# EAGLE design plugin-sensor (EAGLE 9.6.2)
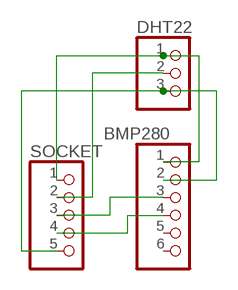
[diagram p0: schematic, sheet 1]

## Parts
BMP280  PINHD-1X6/90  [1X06/90]
DHT22  PINHD-1X3  [1X03]
SOCKET  PINHD-1X5/90  [1X05/90]

## Nets
N$1: BMP280.1 DHT22.1 SOCKET.1
N$2: BMP280.2 DHT22.3 SOCKET.5
N$3: DHT22.2 SOCKET.2
N$5: BMP280.3 SOCKET.3
N$6: BMP280.4 SOCKET.4
Unconnected: BMP280.5 BMP280.6

## Library data of the parts
BMP280 = pinhead:PINHD-1X6: PIN HEADER
DHT22 = pinhead:PINHD-1X3: PIN HEADER
SOCKET = pinhead:PINHD-1X5: PIN HEADER

## Board
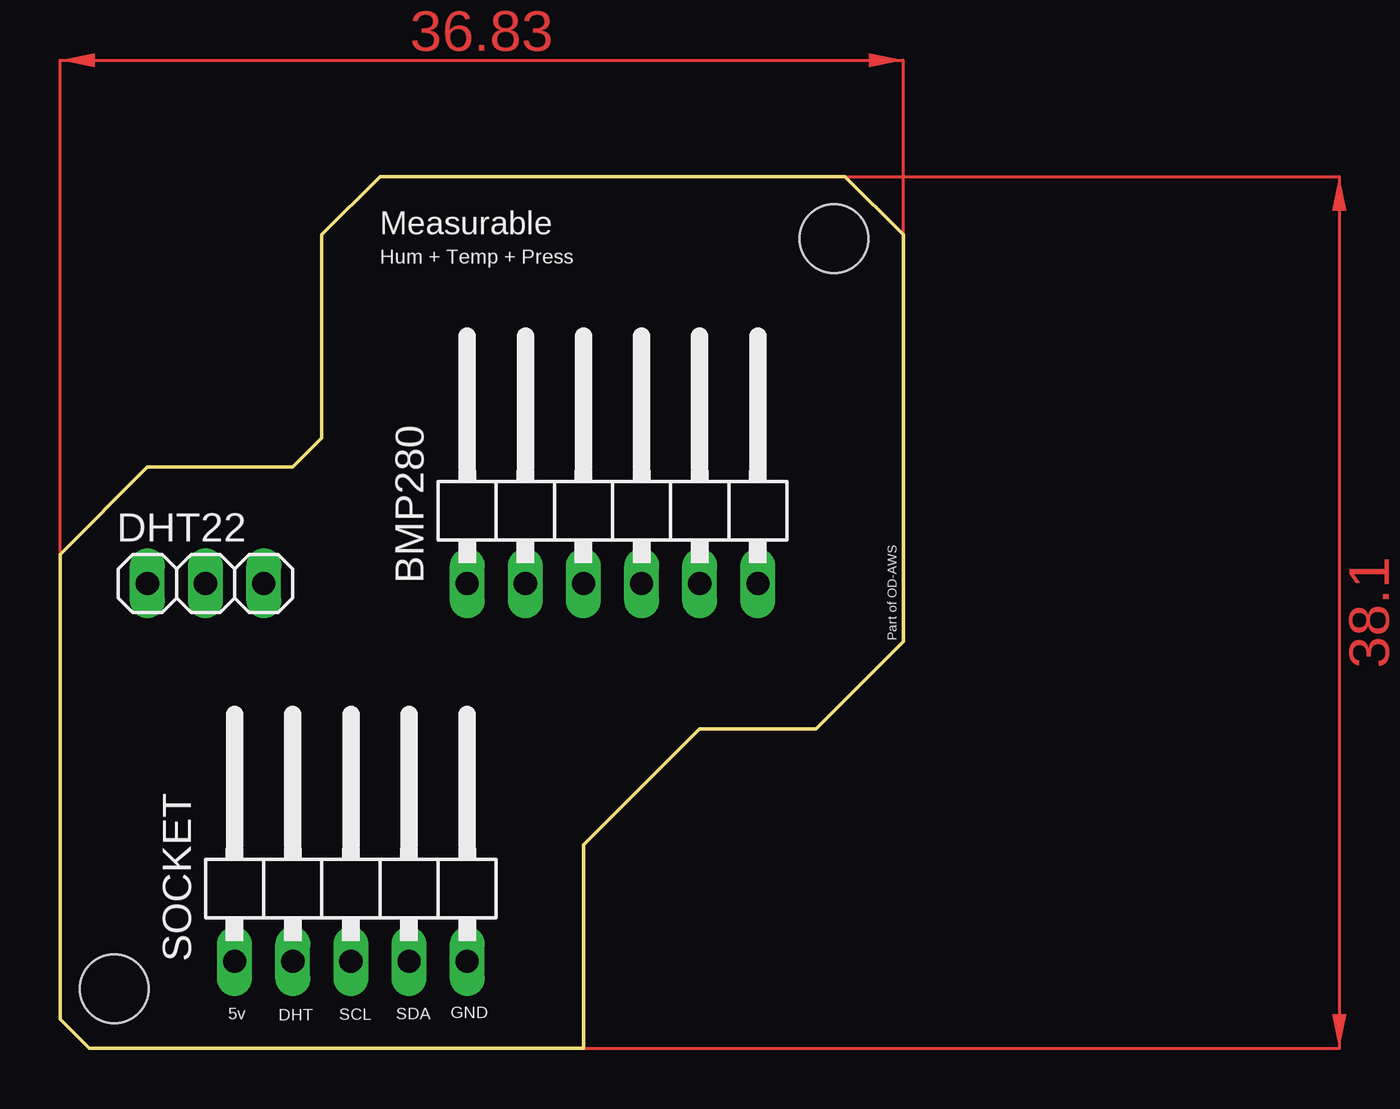
[diagram p1: board, top side]
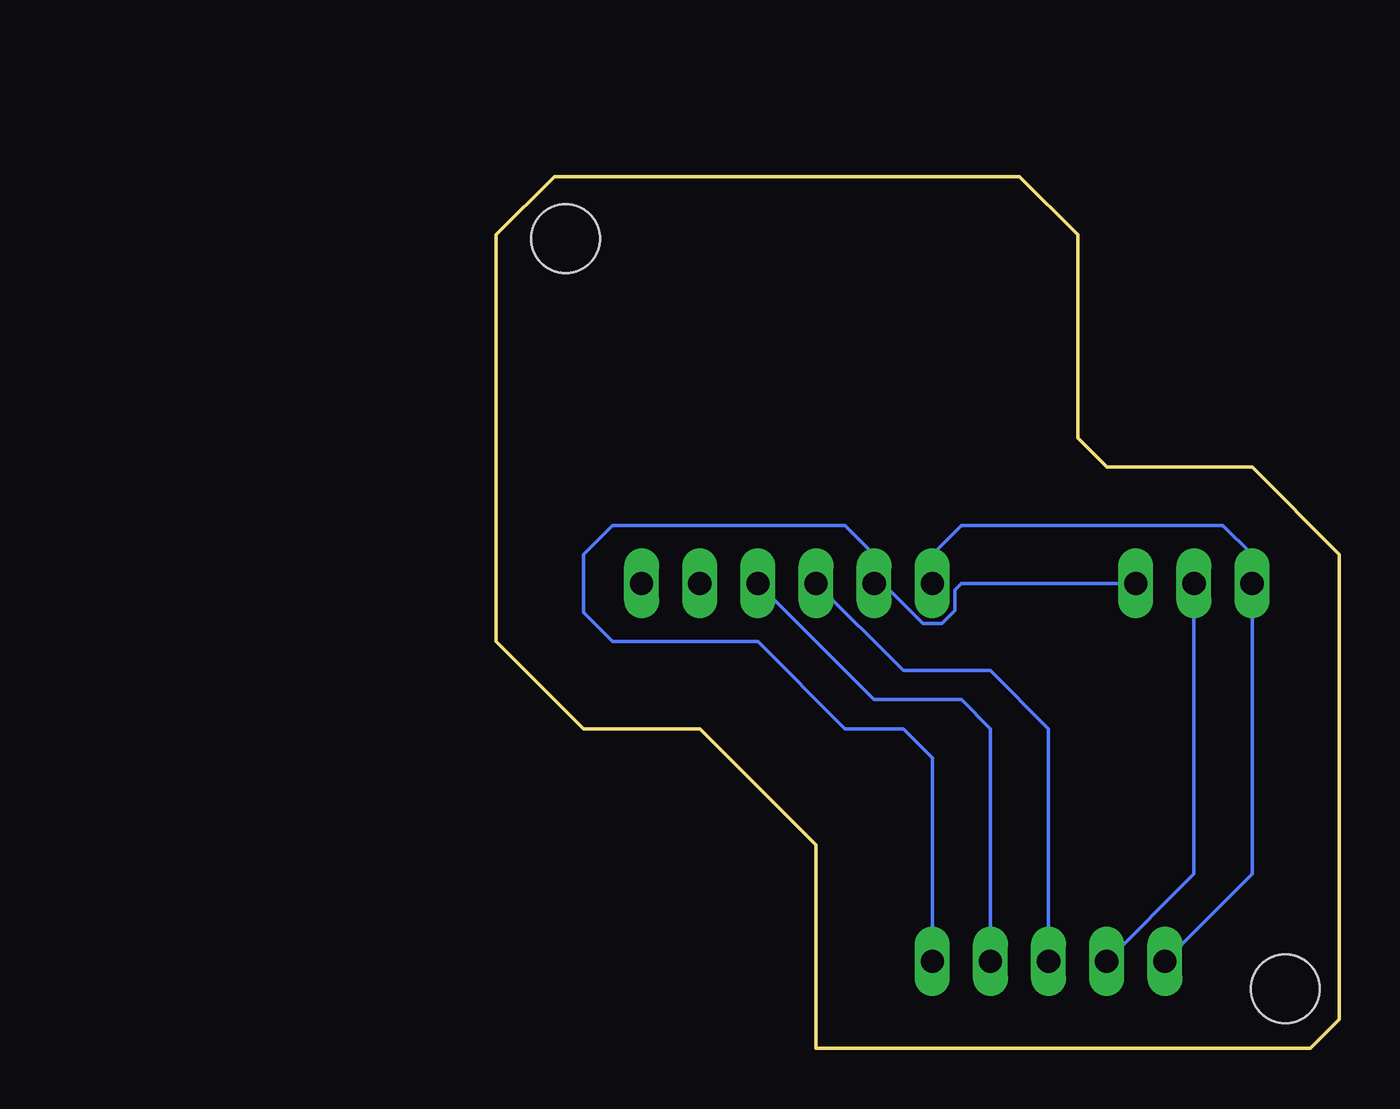
[diagram p2: board, bottom side, seen from below]

Size 36.83 x 38.1 mm. Coordinates in mm from the lower left corner, seen from the top.
Outline: 1.27,0 22.86,0 22.86,8.89 27.94,13.97 33.02,13.97 36.83,17.78 36.83,35.56 34.29,38.1 13.97,38.1 11.43,35.56 11.43,26.67 10.16,25.4 3.81,25.4 0,21.59 0,1.27 1.27,0
Copper layers (1*16): Top 0.035mm / dielectric 1.5mm / Bottom 0.035mm
Design rules "default": minimum track width 6mil, minimum drill 0.35mm, track to track 6mil, track to pad 6mil, pad to pad 6mil, via to via 6mil, smd to smd 6mil, copper to edge 40mil, drill to drill 6mil, minimum pad ring 10mil, minimum via ring 8mil, stop-mask expansion 4mil, vias tented up to drill 0mil, thermal gap 10mil
Holes 3 mm at 33.81,35.38 2.36,2.62

### Footprints (pad centres in the part's own frame; a part is rotated, then mirrored left to right if it is on the bottom)
1X06/90 = drill 1.016 long: 1 -6.35,-3.81; 2 -3.81,-3.81; 3 -1.27,-3.81; 4 1.27,-3.81; 5 3.81,-3.81; 6 6.35,-3.81
1X03 = drill 1.016 long: 1 -2.54,0; 2 0,0; 3 2.54,0
1X05/90 = drill 1.016 long: 1 -5.08,-3.81; 2 -2.54,-3.81; 3 0,-3.81; 4 2.54,-3.81; 5 5.08,-3.81

### Placement (x,y rotation side)
BMP280  24.13,24.13 0 top
DHT22  6.35,20.32 0 top
SOCKET  12.7,7.62 0 top

### Tracks (layer width: path | path; a pad name or v marks a point on that pad's centre or on a via)
N$1
  Bottom 0.152: SOCKET.1 3.81,7.62 DHT22.1 3.81,21.59 5.08,22.86 16.51,22.86 17.78,21.59 BMP280.1
N$2
  Bottom 0.152: DHT22.3 16.51,20.32 16.79,20.04 16.79,19.15 17.37,18.57 18.19,18.57 19.94,20.32 BMP280.2 20.32,21.59 21.59,22.86 31.75,22.86 33.02,21.59 33.02,19.05 31.75,17.78 25.4,17.78 21.59,13.97 19.05,13.97 17.78,12.7 SOCKET.5
N$3
  Bottom 0.152: DHT22.2 6.35,7.62 SOCKET.2
N$5
  Bottom 0.152: BMP280.3 19.05,16.51 15.24,16.51 12.7,13.97 SOCKET.3
N$6
  Bottom 0.152: BMP280.4 20.32,15.24 16.51,15.24 15.24,13.97 SOCKET.4
(copper drawn outside any net)
  shapes: Top area x2

### Text on the board
tPlace: Part of OD-AWS
tNames: Measurable | Hum + Temp + Press | 5v | DHT | SCL | SDA | GND